# EAGLE schematic power_9v_rail (EAGLE 6.5.0)
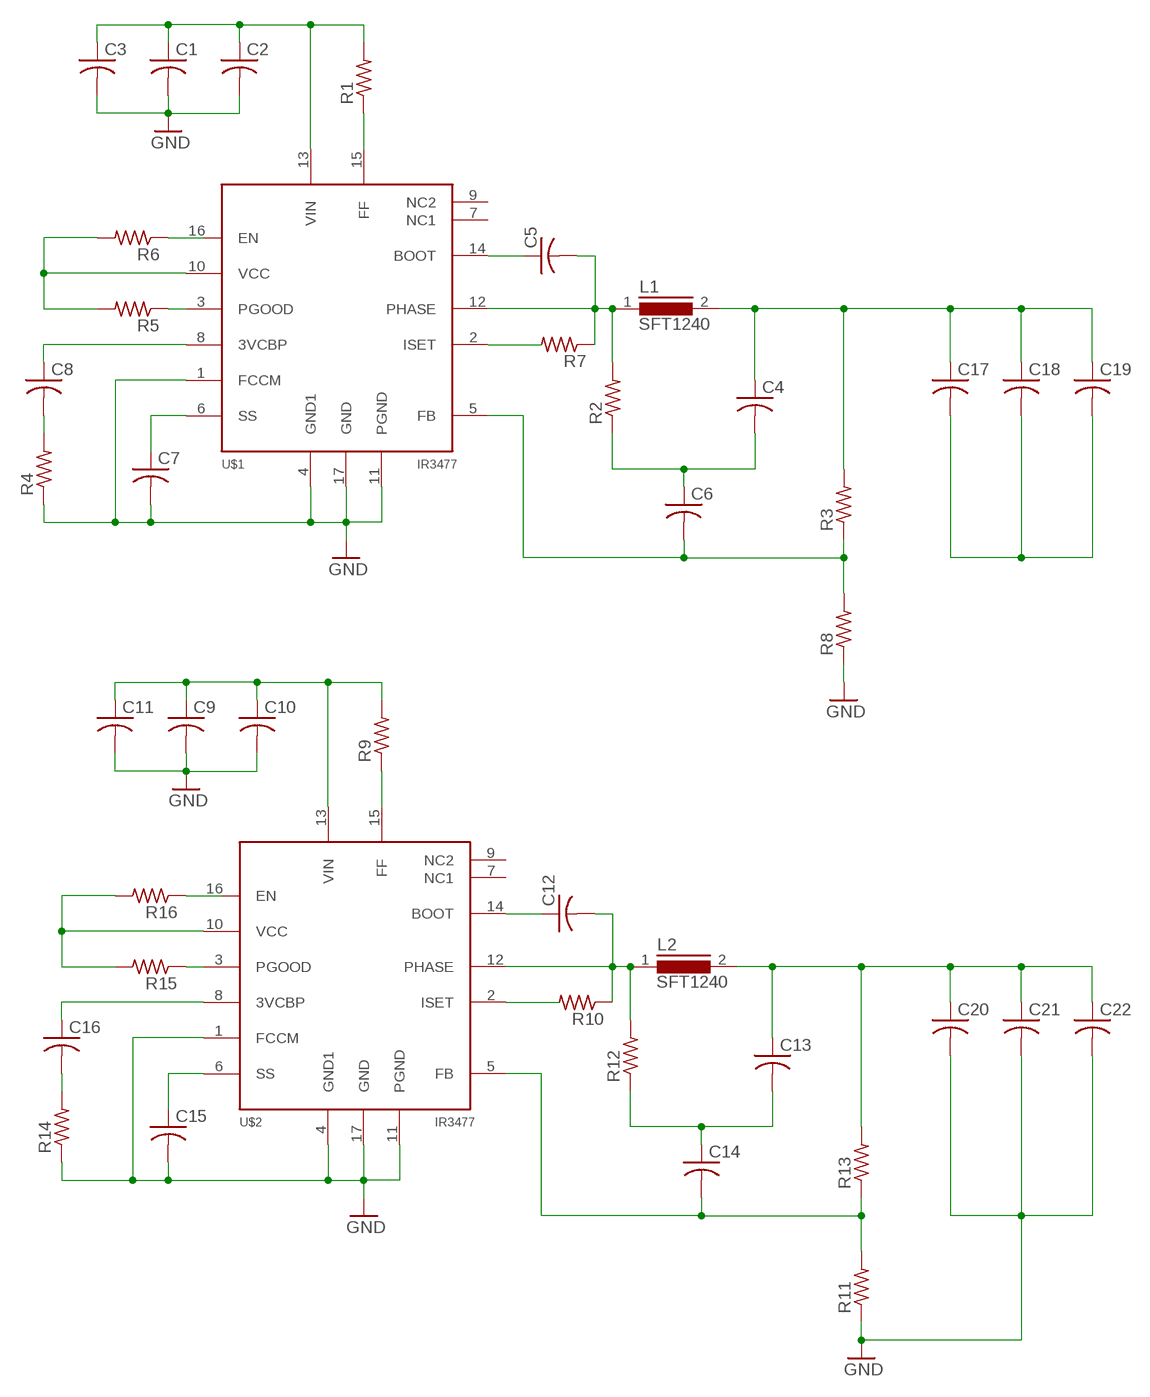
[diagram p0: schematic, sheet 1]

## Parts
C1  C-USC0805K  [C0805K]
C2  C-USC0805K  [C0805K]
C3  C-USC0805K  [C0805K]
C4  C-USC0805K  [C0805K]
C5  C-USC0805K  [C0805K]
C6  C-USC0805K  [C0805K]
C7  C-USC0805K  [C0805K]
C8  C-USC0805K  [C0805K]
C9  C-USC0805K  [C0805K]
C10  C-USC0805K  [C0805K]
C11  C-USC0805K  [C0805K]
C12  C-USC0805K  [C0805K]
C13  C-USC0805K  [C0805K]
C14  C-USC0805K  [C0805K]
C15  C-USC0805K  [C0805K]
C16  C-USC0805K  [C0805K]
C17  C-USC0805K  [C0805K]
C18  C-USC0805K  [C0805K]
C19  C-USC0805K  [C0805K]
C20  C-USC0805K  [C0805K]
C21  C-USC0805K  [C0805K]
C22  C-USC0805K  [C0805K]
L1  SFT1240  [SFT1240]
L2  SFT1240  [SFT1240]
R1  R-US_R0805  [R0805]
R2  R-US_R0805  [R0805]
R3  R-US_R0805  [R0805]
R4  R-US_R0805  [R0805]
R5  R-US_R0805  [R0805]
R6  R-US_R0805  [R0805]
R7  R-US_R0805  [R0805]
R8  R-US_R0805  [R0805]
R9  R-US_R0805  [R0805]
R10  R-US_R0805  [R0805]
R11  R-US_R0805  [R0805]
R12  R-US_R0805  [R0805]
R13  R-US_R0805  [R0805]
R14  R-US_R0805  [R0805]
R15  R-US_R0805  [R0805]
R16  R-US_R0805  [R0805]
U$1  IC-1R34477-SMP  [IC-IR3477-SM]
U$2  IC-1R34477-SMP  [IC-IR3477-SM]

## Nets
GND: C1.2 C2.2 C3.2 C7.2 C9.2 C10.2 C11.2 C15.2 C20.2 C21.2 C22.2 R4.1 R8.1 R11.1 R14.1 U$1.1(FCCM) U$1.4(GND1) U$1.11(PGND) U$1.17(GND) U$2.1(FCCM) U$2.4(GND1) U$2.11(PGND) U$2.17(GND)
N$1: C1.1 C2.1 C3.1 R1.2 U$1.13(VIN)
N$2: C5.1 U$1.14(BOOT)
N$3: R1.1 U$1.15(FF)
N$4: U$1.2(ISET)
N$5: C5.2 L1.1 R2.2 R7.1 U$1.12(PHASE)
N$6: C4.2 C6.1 R2.1
N$7: C4.1 C17.1 C18.1 C19.1 L1.2 R3.2
N$8: C17.2 C18.2 C19.2
N$9: C6.2 R3.1 R8.2 U$1.5(FB)
N$10: C8.2 R4.2
N$11: C14.2 R11.2 R13.1 U$2.5(FB)
N$12: R5.1 U$1.3(PGOOD)
N$13: C7.1 U$1.6(SS)
N$14: R6.1
N$15: R5.2 R6.2 U$1.10(VCC)
N$16: C8.1 U$1.8(3VCBP)
N$17: C9.1 C10.1 C11.1 R9.2 U$2.13(VIN)
N$18: R9.1 U$2.15(FF)
N$19: C12.1 U$2.14(BOOT)
N$20: U$2.2(ISET)
N$21: C12.2 L2.1 R10.1 R12.2 U$2.12(PHASE)
N$22: C13.2 C14.1 R12.1
N$23: C13.1 C20.1 C21.1 C22.1 L2.2 R13.2
N$25: C15.1 U$2.6(SS)
N$26: C16.1 U$2.8(3VCBP)
N$27: C16.2 R14.2
N$28: R15.1 U$2.3(PGOOD)
N$29: R16.1
N$30: R15.2 R16.2 U$2.10(VCC)
Unconnected: R7.2 R10.2 U$1.7(NC1) U$1.9(NC2) U$1.16(EN) U$2.7(NC1) U$2.9(NC2) U$2.16(EN)

## Library data of the parts
C1-C22 = adafruit:C-US: CAPACITOR, American symbol
L1 L2 = inductors:SFT1240: INDUCTOR
R1-R16 = adafruit:R-US_: RESISTOR, American symbol
U$1 U$2 = ic-ir3477-buck:IC-1R34477-SMP